# EAGLE design midi_to_cv (EAGLE 7.1.0)
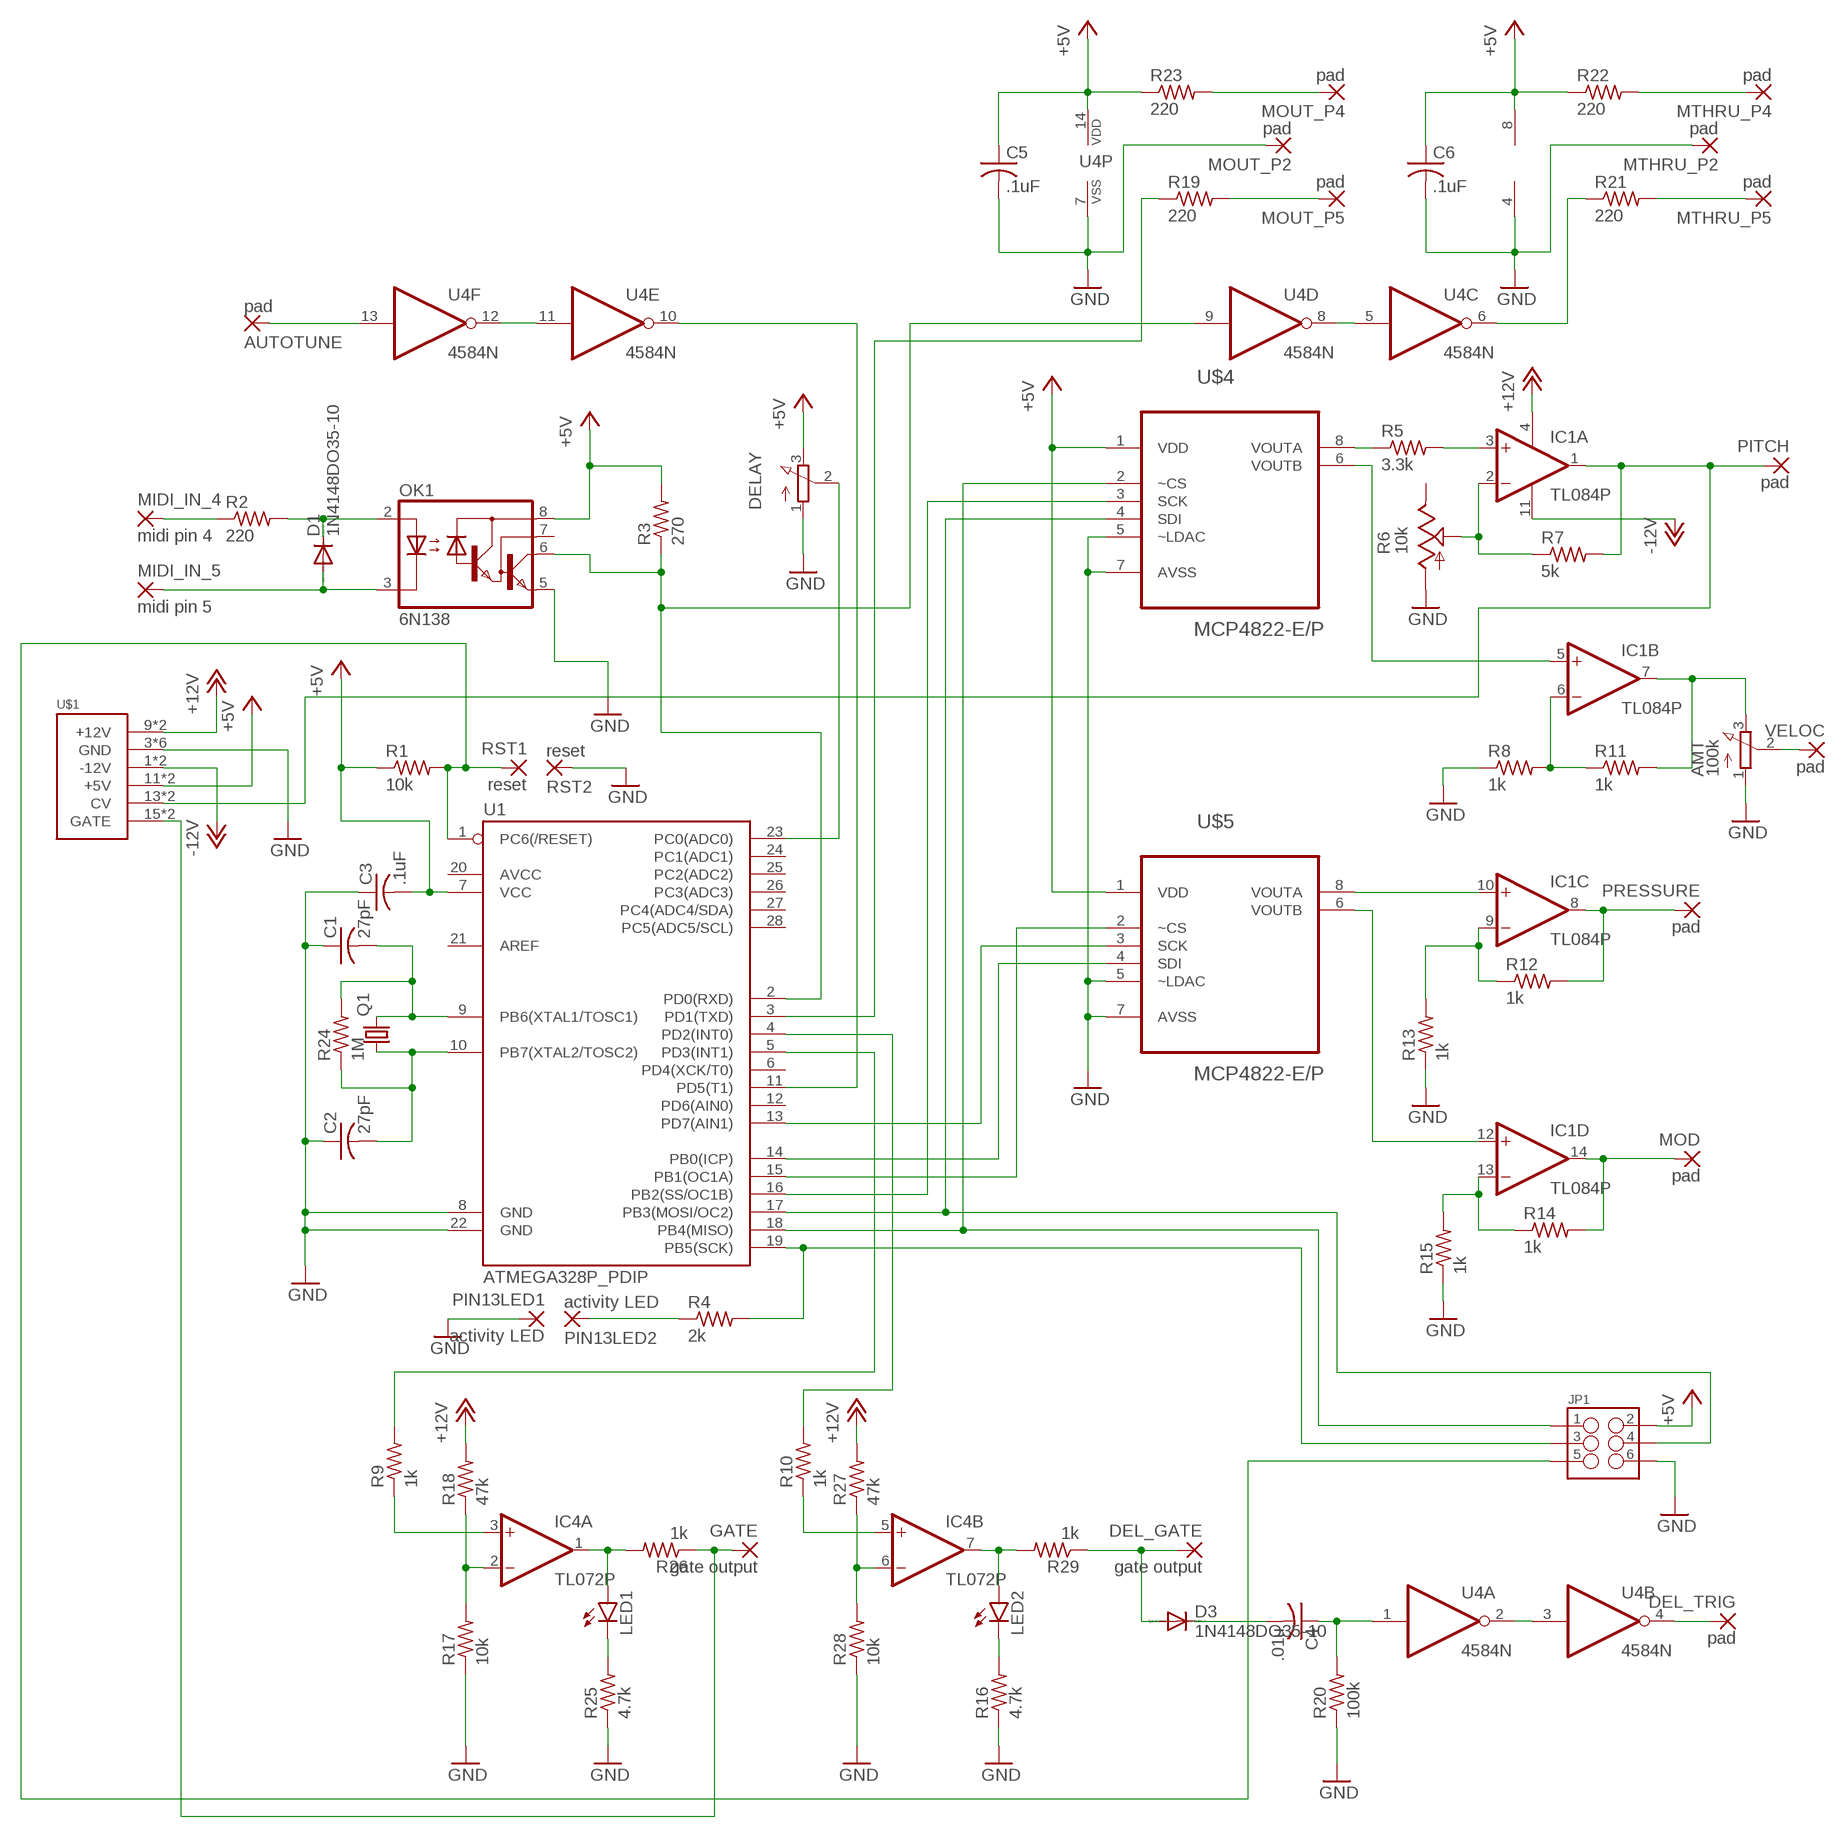
[diagram p0: schematic, sheet 1]

## Parts
AMT  100k  3RP/1610N  [3RP/1610N]
AUTOTUNE  pad  2,54/0,9  [2,54/0,9]
C1  27pF  C-US025-040X050  [C025-040X050]
C2  27pF  C-US025-040X050  [C025-040X050]
C3  .1uF  C-US050-024X044  [C050-024X044]
C4  .01u  C-US050-024X044  [C050-024X044]
C5  .1uF  C-US050-024X044  [C050-024X044]
C6  .1uF  C-US050-024X044  [C050-024X044]
D1  1N4148DO35-10  [DO35-10]
D3  1N4148DO35-10  [DO35-10]
DEL_GATE  gate output  2,54/0,9  [2,54/0,9]
DEL_TRIG  pad  2,54/0,9  [2,54/0,9]
DELAY  3RP/1610N  [3RP/1610N]
GATE  gate output  2,54/0,9  [2,54/0,9]
IC1  TL084P  [DIL14]
IC4  TL072P  [DIL08]
JP1  M03X2NO_SILK  [2X3-NS]
LED1  LED3MM  [LED3MM]
LED2  LED3MM  [LED3MM]
MIDI_IN_4  midi pin 4  2,54/0,9  [2,54/0,9]
MIDI_IN_5  midi pin 5  2,54/0,9  [2,54/0,9]
MOD  pad  2,54/0,9  [2,54/0,9]
MOUT_P2  pad  2,54/0,9  [2,54/0,9]
MOUT_P4  pad  2,54/0,9  [2,54/0,9]
MOUT_P5  pad  2,54/0,9  [2,54/0,9]
MTHRU_P2  pad  2,54/0,9  [2,54/0,9]
MTHRU_P4  pad  2,54/0,9  [2,54/0,9]
MTHRU_P5  pad  2,54/0,9  [2,54/0,9]
OK1  6N138  [DIL08]
PIN13LED1  activity LED  2,54/0,9  [2,54/0,9]
PIN13LED2  activity LED  2,54/0,9  [2,54/0,9]
PITCH  pad  2,54/0,9  [2,54/0,9]
PRESSURE  pad  2,54/0,9  [2,54/0,9]
Q1  CRYSTALHC33U-V  [HC33U-V]
R1  10k  R-US_0207/10  [0207/10]
R2  220  R-US_0207/10  [0207/10]
R3  270  R-US_0207/10  [0207/10]
R4  2k  R-US_0207/10  [0207/10]
R5  3.3k  R-US_0207/10  [0207/10]
R6  10k  TRIM_US-B64W  [B64W]
R7  5k  R-US_0207/10  [0207/10]
R8  1k  R-US_0207/10  [0207/10]
R9  1k  R-US_0207/10  [0207/10]
R10  1k  R-US_0207/10  [0207/10]
R11  1k  R-US_0207/10  [0207/10]
R12  1k  R-US_0207/10  [0207/10]
R13  1k  R-US_0207/10  [0207/10]
R14  1k  R-US_0207/10  [0207/10]
R15  1k  R-US_0207/10  [0207/10]
R16  4.7k  R-US_0207/10  [0207/10]
R17  10k  R-US_0207/10  [0207/10]
R18  47k  R-US_0207/10  [0207/10]
R19  220  R-US_0207/10  [0207/10]
R20  100k  R-US_0207/10  [0207/10]
R21  220  R-US_0207/10  [0207/10]
R22  220  R-US_0207/10  [0207/10]
R23  220  R-US_0207/10  [0207/10]
R24  1M  R-US_0207/10  [0207/10]
R25  4.7k  R-US_0207/10  [0207/10]
R26  1k  R-US_0207/10  [0207/10]
R27  47k  R-US_0207/10  [0207/10]
R28  10k  R-US_0207/10  [0207/10]
R29  1k  R-US_0207/10  [0207/10]
RST1  reset  2,54/0,9  [2,54/0,9]
RST2  reset  2,54/0,9  [2,54/0,9]
U1  ATMEGA328P_PDIP  [DIL28-3]
U4  4584N  [DIL14]
U$1  POWER  [POWER_16]
U$4  MCP4822-E/P  [DIP254P762X432-8]
U$5  MCP4822-E/P  [DIP254P762X432-8]
VELOC  pad  2,54/0,9  [2,54/0,9]

## Nets
+5V: C3.2 C5.1 C6.1 DELAY.3(E) IC4.8(P:V+) JP1.2 OK1.8(VCC) R1.1 R3.2 R22.1 R23.1 U1.7(VCC) U4.14(P:VDD) U$1.11(+5V) U$1.12(+5V) U$4.1(VDD) U$5.1(VDD)
+12V: IC1.4(P:V+) R18.2 R27.2 U$1.9(+12V) U$1.10(+12V)
-12V: IC1.11(P:V-) U$1.1(-12V) U$1.2(-12V)
GND: AMT.1(A) C1.1 C2.1 C3.1 C5.2 C6.2 DELAY.1(A) IC4.4(P:V-) JP1.6 MOUT_P2.1(P) MTHRU_P2.1(P) OK1.5(GND) PIN13LED1.1(P) R6.A R8.1 R13.1 R15.1 R16.1 R17.1 R20.1 R25.1 R28.1 RST2.1(P) U1.8(GND) U1.22(GND) U4.7(P:VSS) U$1.3(GND) U$1.4(GND) U$1.5(GND) U$1.6(GND) U$1.7(GND) U$1.8(GND) U$4.5(~LDAC) U$4.7(AVSS) U$5.5(~LDAC) U$5.7(AVSS)
N$1: IC4.3(A:+IN) R9.1
N$2: R5.1 U$4.8(VOUTA)
N$3: D1.A MIDI_IN_5.1(P) OK1.3(C)
N$4: C1.2 Q1.2 R24.2 U1.9(PB6(XTAL1/TOSC1))
N$5: C2.2 Q1.1 R24.1 U1.10(PB7(XTAL2/TOSC2))
N$6: IC1.3(A:+IN) R5.2
N$7: D1.C OK1.2(A) R2.2
N$8: MIDI_IN_4.1(P) R2.1
N$9: IC1.1(A:OUT) PITCH.1(P) R7.2 U$1.13(CV) U$1.14(CV)
N$10: JP1.3 R4.2 U1.19(PB5(SCK))
N$11: PIN13LED2.1(P) R4.1
N$12: IC1.2(A:-IN) R6.S R7.1
N$13: IC1.6(B:-IN) R8.2 R11.1
N$14: IC1.5(B:+IN) U$4.6(VOUTB)
N$15: IC4.2(A:-IN) R17.2 R18.1
N$16: IC4.1(A:OUT) LED1.A R26.2
N$17: AMT.3(E) IC1.7(B:OUT) R11.2
N$18: IC1.10(C:+IN) U$5.8(VOUTA)
N$19: IC1.8(C:OUT) PRESSURE.1(P) R12.2
N$20: IC1.9(C:-IN) R12.1 R13.2
N$21: IC1.14(D:OUT) MOD.1(P) R14.2
N$22: IC1.13(D:-IN) R14.1 R15.2
N$23: U1.14(PB0(ICP)) U$5.4(SDI)
N$24: IC1.12(D:+IN) U$5.6(VOUTB)
N$25: U1.16(PB2(SS/OC1B)) U$4.3(SCK)
N$26: JP1.4 U1.17(PB3(MOSI/OC2)) U$4.4(SDI)
N$27: DELAY.2(S) U1.23(PC0(ADC0))
N$28: U1.13(PD7(AIN1)) U$5.3(SCK)
N$29: U1.15(PB1(OC1A)) U$5.2(~CS)
N$30: OK1.6(VO) R3.1 U1.2(PD0(RXD)) U4.9(D:I)
N$31: GATE.1(P) R26.1 U$1.15(GATE) U$1.16(GATE)
N$32: R10.2 U1.4(PD2(INT0))
N$33: R9.2 U1.5(PD3(INT1))
N$34: AUTOTUNE.1(P) U4.13(F:I)
N$35: D3.A DEL_GATE.1(P) R29.1
N$36: LED2.K(C) R16.2
N$37: U4.11(E:I) U4.12(F:O)
N$38: U1.11(PD5(T1)) U4.10(E:O)
N$39: U4.5(C:I) U4.8(D:O)
N$40: U4.2(A:O) U4.3(B:I)
N$41: C4.1 R20.2 U4.1(A:I)
N$42: IC4.5(B:+IN) R10.1
N$43: JP1.5 R1.2 RST1.1(P) U1.1(PC6(/RESET))
N$44: IC4.6(B:-IN) R27.1 R28.2
N$45: JP1.1 U1.18(PB4(MISO)) U$4.2(~CS)
N$46: MOUT_P5.1(P) R19.2
N$47: LED1.K(C) R25.2
N$48: C4.2 D3.C
N$49: DEL_TRIG.1(P) U4.4(B:O)
N$50: R21.1 U4.6(C:O)
N$51: AMT.2(S) VELOC.1(P)
N$52: MTHRU_P5.1(P) R21.2
N$53: IC4.7(B:OUT) LED2.A R29.2
N$54: MTHRU_P4.1(P) R22.2
N$55: MOUT_P4.1(P) R23.2
N$57: R19.1 U1.3(PD1(TXD))
Unconnected: OK1.7(VB) R6.E U1.6(PD4(XCK/T0)) U1.12(PD6(AIN0)) U1.20(AVCC) U1.21(AREF) U1.24(PC1(ADC1)) U1.25(PC2(ADC2)) U1.26(PC3(ADC3)) U1.27(PC4(ADC4/SDA)) U1.28(PC5(ADC5/SCL))

## Library data of the parts
AMT DELAY = pot:3RP/1610N: 16mm Potentiometer one level Source: http://www.alphapotentiometers.net/html/16mm_pot_2.html
AUTOTUNE DEL_GATE DEL_TRIG GATE MIDI_IN_4 MIDI_IN_5 MOD MOUT_P2 MOUT_P4 MOUT_P5 MTHRU_P2 MTHRU_P4 MTHRU_P5 PIN13LED1 PIN13LED2 PITCH PRESSURE RST1 RST2 VELOC = wirepad:2,54/0,9: THROUGH-HOLE PAD
C1-C6 = rcl:C-US: CAPACITOR, American symbol
D1 D3 = diode:1N4148: DIODE high speed (Philips)
IC1 = linear:TL084: OP AMP
IC4 = linear:TL072: OP AMP
JP1 = SparkFun-Connectors:M03X2: 2x3 .1" header. Shrouded, with keying- CONN-10681 SMT- CONN-11415 Pogo pins- HW-11044
LED1 LED2 = SparkFun-LED:LED: LEDs Standard schematic elements and footprints for 5mm, 3mm, 1206, and 0603 sized LEDs. 5mm - Spark Fun Electronics SKU : COM-00529 (and others)
OK1 = optocoupler:6N138: MOTOROLA OPTO COUPLER; MF: VISHAY/TELEFUNKEN; MPN: 6N138; OC_FARNELL: 9860150; OC_NEWARK: 35K5294
Q1 = crystal:CRYSTAL: CRYSTAL; OC_FARNELL: unknown; OC_NEWARK: unknown
R1-R5 R7-R29 = rcl:R-US_: RESISTOR, American symbol
R6 = pot:TRIM_US-: POTENTIOMETER
U1 = SparkFun-DigitalIC:ATMEGA328P_PDIP: uC used in the Arduino 32kb flash, 1k EEPROM, 2k SRAM This is the through-hole version of this chip.
U4 = TR808clone:4584: Hex SCHMITT TRIGGER (74C14)
U$1 = eurorack:POWER
U$4 U$5 = MCP4822:MCP4822-E/P: DAC; MPN: MCP4822-E/P; OC_FARNELL: 1439413; OC_NEWARK: 11M1705; PACKAGE: DIP-8; SUPPLIER: Microchip

## Net classes
1 GND: width 1.016 mm, drill 1.016 mm, clearance 0.508 mm

## Board
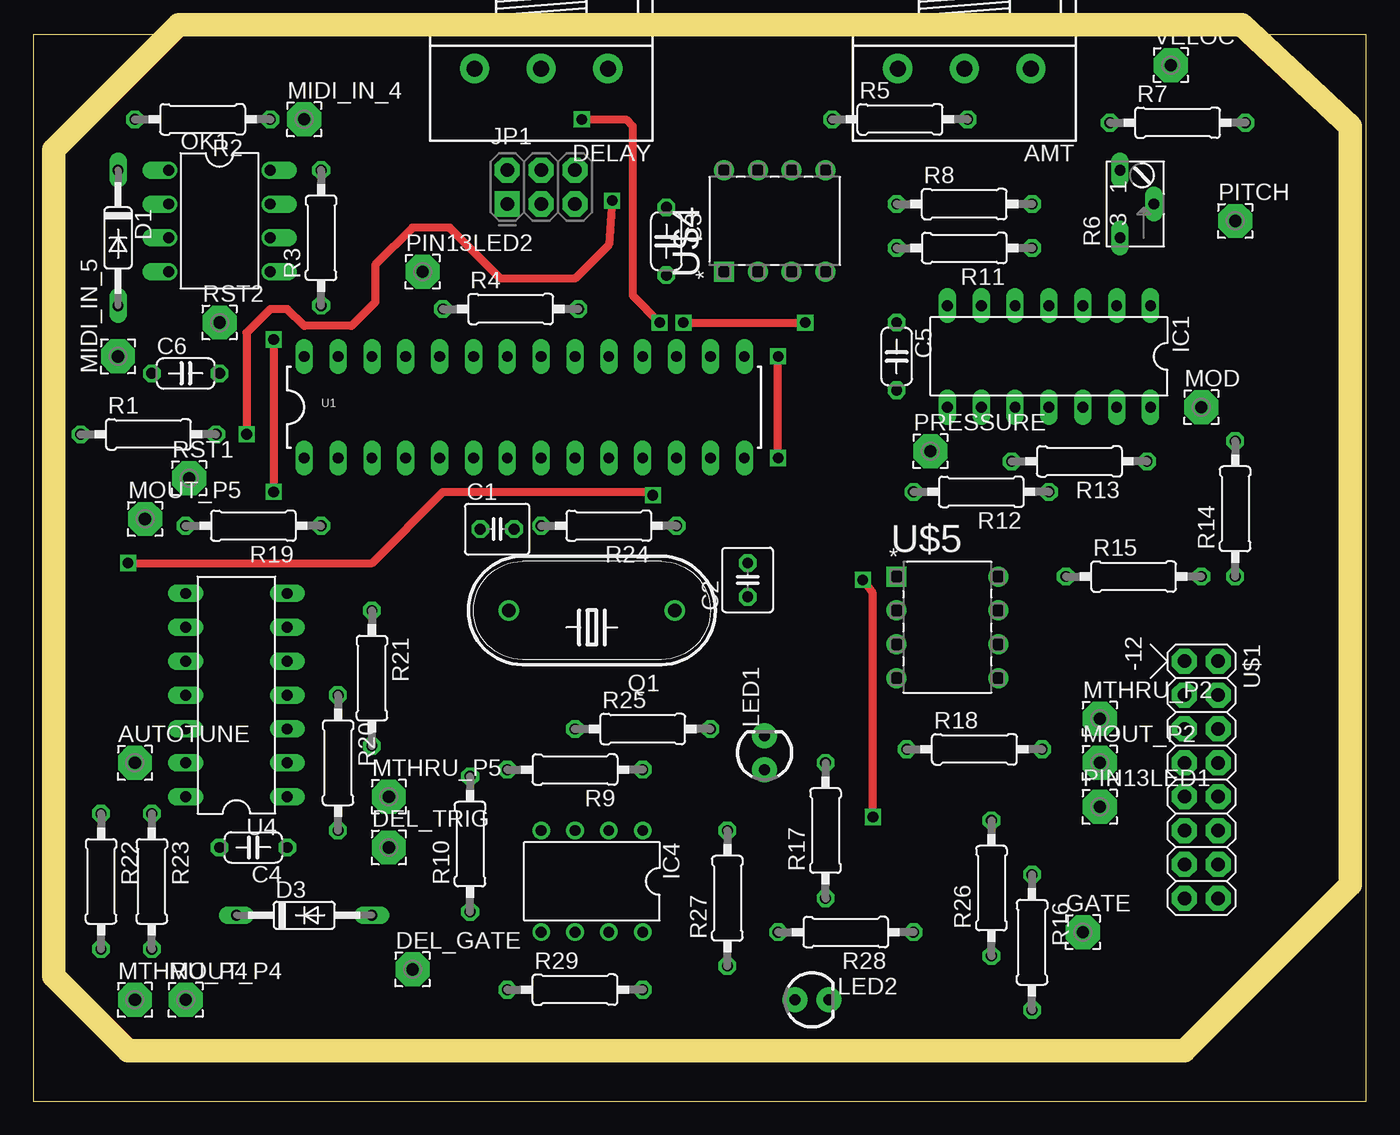
[diagram p1: board, top side]
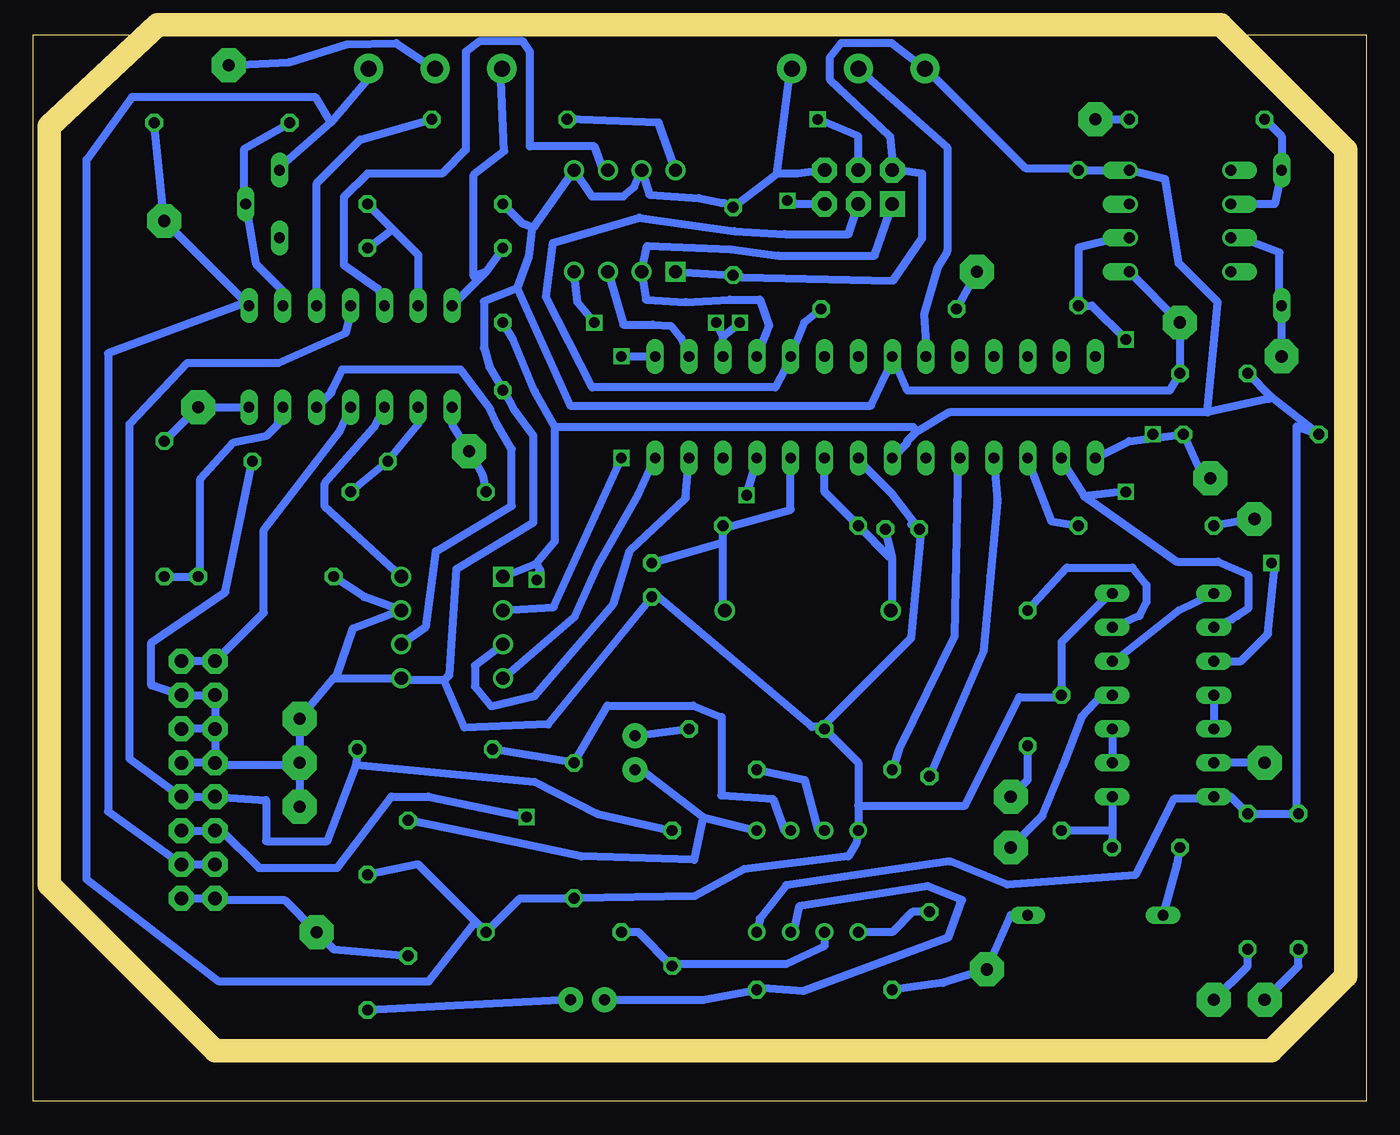
[diagram p2: board, bottom side, seen from below]

Size 100 x 80 mm. Coordinates in mm from the lower left corner, seen from the top.
Outline: 0,0 100,0 100,80 0,80 0,0
Copper layers (1*16): Top 0.035mm / dielectric 1.5mm / Bottom 0.035mm
Design rules "default *": minimum track width 24mil, minimum drill 24mil, track to track 16mil, track to pad 16mil, pad to pad 16mil, via to via 8mil, smd to smd 8mil, copper to edge 0mil, drill to drill 8mil, minimum pad ring 10mil, minimum via ring 8mil, stop-mask expansion 4mil, vias tented up to drill 0mil, thermal gap 10mil
Milling: 8 lines

### Footprints (pad centres in the part's own frame; a part is rotated, then mirrored left to right if it is on the bottom)
3RP/1610N = drill 1.2 pad 2.184: 1 -5,0; 2 0,0; 3 5,0
2,54/0,9 = drill 0.914 pad 2.54 octagon: 1 0,0
C025-040X050 = drill 0.813 octagon: 1 -1.27,0; 2 1.27,0
C050-024X044 = drill 0.813 octagon: 1 -2.54,0; 2 2.54,0
DO35-10 = drill 0.813 long: A 5.08,0; C -5.08,0
DIL14 = drill 0.813 long: 1 -7.62,-3.81; 2 -5.08,-3.81; 3 -2.54,-3.81; 4 0,-3.81; 5 2.54,-3.81; 6 5.08,-3.81; 7 7.62,-3.81; 8 7.62,3.81; 9 5.08,3.81; 10 2.54,3.81; 11 0,3.81; 12 -2.54,3.81; 13 -5.08,3.81; 14 -7.62,3.81
DIL08 = drill 0.813 pad 1.27: 1 -3.81,-3.81; 2 -1.27,-3.81; 3 1.27,-3.81; 4 3.81,-3.81; 5 3.81,3.81; 6 1.27,3.81; 7 -1.27,3.81; 8 -3.81,3.81
2X3-NS = drill 1.016 pad 1.88 square: 1 -2.54,-1.27 | drill 1.016 pad 1.88 octagon: 2 -2.54,1.27; 3 0,-1.27; 4 0,1.27; 5 2.54,-1.27; 6 2.54,1.27
LED3MM = drill 0.813 pad 1.88: A -1.27,0; K 1.27,0
DIL08' = drill 0.813 offset: 1 -3.81,-3.81; 2 -1.27,-3.81; 3 1.27,-3.81; 4 3.81,-3.81; 5 3.81,3.81; 6 1.27,3.81; 7 -1.27,3.81; 8 -3.81,3.81
HC33U-V = drill 1.016: 1 -6.223,0; 2 6.223,0
0207/10 = drill 0.813 octagon: 1 -5.08,0; 2 5.08,0
B64W = drill 0.813 long: A 2.54,0; E -2.54,0; S 0,-2.54
DIL28-3 = drill 0.813 long: 1 -16.51,-3.81; 2 -13.97,-3.81; 3 -11.43,-3.81; 4 -8.89,-3.81; 5 -6.35,-3.81; 6 -3.81,-3.81; 7 -1.27,-3.81; 8 1.27,-3.81; 9 3.81,-3.81; 10 6.35,-3.81; 11 8.89,-3.81; 12 11.43,-3.81; 13 13.97,-3.81; 14 16.51,-3.81; 15 16.51,3.81; 16 13.97,3.81; 17 11.43,3.81; 18 8.89,3.81; 19 6.35,3.81; 20 3.81,3.81; 21 1.27,3.81; 22 -1.27,3.81; 23 -3.81,3.81; 24 -6.35,3.81; 25 -8.89,3.81; 26 -11.43,3.81; 27 -13.97,3.81; 28 -16.51,3.81
POWER_16 = drill 1.016 pad 1.88 octagon: 1 -6.35,-1.27; 2 -6.35,1.27; 3 -3.81,-1.27; 4 -3.81,1.27; 5 -1.27,-1.27; 6 -1.27,1.27; 7 1.27,-1.27; 8 1.27,1.27; 9 3.81,-1.27; 10 3.81,1.27; 11 6.35,-1.27; 12 6.35,1.27; 13 8.89,-1.27; 14 8.89,1.27; 15 11.43,-1.27; 16 11.43,1.27
DIP254P762X432-8 = drill 0.991 square: 1 -7.62,7.62 | drill 0.991: 2 -7.62,5.08; 3 -7.62,2.54; 4 -7.62,0; 5 0,0; 6 0,2.54; 7 0,5.08; 8 0,7.62

### Placement (x,y rotation side)
AMT  69.85,77.47 180 top
AUTOTUNE  7.62,25.4 0 top
C1  34.8,42.93 0 top
C2  53.59,39.12 90 top
C3  47.5,64.52 270 top
C4  16.51,19.05 180 top
C5  64.77,55.88 270 top
C6  11.43,54.61 0 top
D1  6.35,64.77 270 top
D3  20.32,13.97 0 top
DEL_GATE  28.45,9.91 0 top
DEL_TRIG  26.67,19.05 0 top
DELAY  38.1,77.47 180 top
GATE  78.74,12.7 0 top
IC1  76.2,55.88 180 top
IC4  41.91,16.51 180 top
JP1  38.1,68.58 0 top
LED1  54.86,26.16 90 top
LED2  58.42,7.62 0 top
MIDI_IN_4  20.32,73.66 0 top
MIDI_IN_5  6.35,55.88 90 top
MOD  87.63,52.07 0 top
MOUT_P2  80.01,25.4 0 top
MOUT_P4  11.43,7.62 0 top
MOUT_P5  8.38,43.69 0 top
MTHRU_P2  80.01,28.7 0 top
MTHRU_P4  7.62,7.62 0 top
MTHRU_P5  26.67,22.86 0 top
OK1  6N138  [DIL08']  13.97,66.04 270 top
PIN13LED1  80.01,22.1 0 top
PIN13LED2  29.21,62.23 0 top
PITCH  90.17,66.04 0 top
PRESSURE  67.31,48.77 0 top
Q1  41.91,36.83 180 top
R1  8.64,50.04 0 top
R2  12.7,73.66 180 top
R3  21.59,64.77 90 top
R4  35.81,59.44 0 top
R5  65.02,73.66 0 top
R6  81.53,67.31 90 top
R7  85.85,73.41 0 top
R8  69.85,67.31 0 top
R9  40.64,24.89 180 top
R10  32.77,19.3 90 top
R11  69.85,64.01 180 top
R12  71.12,45.72 180 top
R13  78.49,48.01 180 top
R14  90.17,44.45 90 top
R15  82.55,39.37 0 top
R16  74.93,11.94 270 top
R17  59.44,20.32 90 top
R18  70.61,26.42 0 top
R19  16.51,43.18 180 top
R20  22.86,25.4 270 top
R21  25.4,31.75 270 top
R22  5.08,16.51 270 top
R23  8.89,16.51 270 top
R24  43.18,43.18 180 top
R25  45.72,27.94 0 top
R26  71.88,16 90 top
R27  52.07,15.24 90 top
R28  60.96,12.7 180 top
R29  40.64,8.38 0 top
RST1  11.68,46.74 0 top
RST2  13.97,58.42 0 top
U1  36.83,52.07 0 top
U4  15.24,30.48 90 top
U$1  87.63,26.67 270 top
U$4  59.44,69.85 90 top
U$5  72.39,31.75 0 top
VELOC  85.34,77.72 0 top

### Tracks (layer width: path | path; a pad name or v marks a point on that pad's centre or on a via)
+5V  (via drill 0.8)
  Top 0.61: v62.99,21.34 62.99,38.1 v62.23,39.12
  Bottom 0.61: IC4.8 45.5,13.72 43.5,16.22 31.24,18 26.92,16.26 17.34,16.99 14.41,22.7 11.59,22.7 U4.14 10.16,22.86 R23.1 R22.1 5.24,21.75 5.24,50.64 R1.1 7.14,52.86 | U$4.1 C3.2 46.83,61.82 35.5,61.56 33.31,64.77 33.31,69.6 35.08,69.85 JP1.2 35.47,69.75 35.72,72.39 40.26,76.68 40.26,78.26 39.4,79.38 35.59,79.38 33.34,77.63 DELAY.3 33.02,77.47 25.56,70.01 21.75,70.01 R3.2 OK1.8 15.08,69.18 14.06,62.87 11.14,59.94 11.91,51.69 | C5.1 64.01,57.18 62.39,53.28 60.87,50.58 | 60.87,50.58 60.87,42.01 62.23,40.39 | U$5.1 62.23,40.39 | C6.1 7.14,52.86 | U1.7 34.45,49.37 34.45,49.53 33.81,50.16 | 33.81,50.16 31.27,51.69 11.91,51.69 | 11.91,51.69 7.3,52.7 7.14,52.86 | 60.87,50.58 33.97,50.58 33.81,50.16 | U$1.12 U$1.11 85.85,20.32 83.06,17.53 77.22,17.53 73.15,22.86 70.36,22.86 v62.99,21.34 | v62.23,39.12 61.98,39.88 62.23,40.39
+12V
  Bottom 0.61: R27.2 57.72,21.59 62.39,23.97 75.79,25.24 | R18.2 75.79,25.24 | IC1.4 76.3,58.58 76.55,57.66 81.6,55.4 88.42,55.4 92.77,50.8 92.77,25.72 U$1.10 U$1.9 82.55,22.61 82.55,19.53 77.95,19.53 75.79,25.24
-12V
  Bottom 0.61: IC1.11 76.96,50.39 82.71,42.86 82.71,36.67 U$1.1 U$1.2
GND
  Bottom 0.61: OK1.5 RST2.1 C6.2 14.76,53.31 34.42,53.31 35.21,55.12 35.21,55.28 U1.22 35.56,55.56 37.15,52.2 59.72,52.2 63.69,60.99 | 44.2,69.6 42.67,69.6 JP1.6 | 44.2,69.6 C3.1 48.16,67.41 48.39,67.41 50.07,67.75 53.78,68.01 U$4.7 54.93,68.58 55.75,67.88 58.1,67.88 U$4.5 62.42,65.6 62.58,65.6 | 44.2,69.6 43.18,77.47 DELAY.1 | 63.69,60.99 62.83,63.37 62.58,65.6 | 63.69,60.99 66.2,60.01 66.2,56.52 65.79,55.09 C5.2 64.61,53.18 63.85,51.78 62.48,49.91 62.48,43.43 68.26,39.94 68.77,32 69.18,31.59 | 62.58,65.6 63.34,65.88 R8.1 | MOUT_P2.1 PIN13LED1.1 | R15.1 75.18,37.85 U$5.7 76.04,35.47 77.31,31.75 | 77.31,31.75 77.47,31.75 MTHRU_P2.1 MOUT_P2.1 | 77.31,31.75 U$5.5 72.23,31.59 69.18,31.59 | U$1.5 U$1.7 | U$1.7 U$1.8 | U$1.5 U$1.6 | R13.1 85.6,38.2 91.15,34.42 91.15,31.21 U$1.4 U$1.3 U$1.5 | MOUT_P2.1 80.17,25.24 86.2,25.24 U$1.7 | R6.A 81.76,69.85 77.69,73.41 | 77.69,73.41 74.93,76.68 74.93,77.47 AMT.1 | R16.1 71.12,17.78 66.83,13.49 | 66.83,13.49 R28.1 63.5,15.24 R17.1 50.39,15.4 46.67,17.43 38.86,18.38 38.26,19.4 IC4.4 38.1,22.19 | U4.7 19.21,38.1 22.86,34.45 R20.1 23.02,30.32 26.04,30.32 30.1,22.19 38.1,22.19 | U1.8 38.1,48.1 35.56,45.56 C1.1 34.13,43.27 33.37,42.55 33.37,42.8 34.13,34.77 40.64,28.26 R25.1 | 38.1,22.19 38.1,25.4 R25.1 | R25.1 40.8,28.1 41.59,28.1 53.12,37.85 C2.1 61.37,28.29 67.66,28.04 69.18,31.59 | 77.69,73.41 78.87,75.34 92.58,75.34 96.01,70.64 96.01,16.67 86.04,8.98 70.33,8.98 66.83,13.49
N$1
  Bottom 0.61: IC4.3 41.12,20.32 42.13,24.13 R9.1
N$2
  Bottom 0.61: R5.1 53.09,73.41 U$4.8
N$3
  Bottom 0.61: MIDI_IN_5.1 D1.A 6.51,59.85 6.51,63.69 9.37,64.77 OK1.3
N$4
  Bottom 0.61: 35.56,40.8 35.56,36.83 Q1.2 | 35.56,40.8 C1.2 | 35.56,40.8 35.72,40.8 R24.2 40.64,45.72 U1.9
N$5
  Bottom 0.61: 48.26,41.91 48.26,36.83 Q1.1 | 48.26,41.91 R24.1 48.1,43.02 43.18,44.39 U1.10 | 48.26,41.91 C2.2
N$6
  Bottom 0.61: R5.2 75.47,72.14 78.74,68.87 IC1.3
N$7
  Bottom 0.61: R2.2 6.35,72.39 D1.C 6.86,67.31 OK1.2
N$8
  Bottom 0.61: MIDI_IN_4.1 R2.1
N$9
  Bottom 0.61: U$1.13 U$1.14 94.39,21.75 94.39,56.1 84.3,59.85 IC1.1 PITCH.1 R7.2
N$10
  Bottom 0.61: R4.2 42.16,58.42 U1.19 43.18,55.72 44.32,53.56 58.07,53.56 61.53,60.33 61.02,64.39 54.55,66.29 47.4,65.28 43.62,65.06 38.83,65.06 JP1.3
N$11
  Bottom 0.61: PIN13LED2.1 R4.1
N$12
  Bottom 0.61: IC1.2 81.28,60.8 83.31,62.83 R6.S 84.17,67.72 84.17,71.44 81.19,73.15 R7.1
N$13
  Bottom 0.61: IC1.6 71.12,63.5 73.03,65.41 | R8.2 73.03,65.41 | 73.03,65.41 R11.1
N$14
  Bottom 0.61: U$4.6 57.15,69.6 57.91,71.63 62.74,71.63 62.74,78.74 63.25,79.5 66.55,79.5 67.56,78.74 67.56,71.37 69.34,69.6 74.93,69.6 76.71,67.82 76.71,62.74 74.93,61.47 74.17,60.96 IC1.5
N$15
  Bottom 0.61: IC4.2 43.66,20.32 44.51,22.7 48.39,22.95 48.35,25.97 48.35,28.83 50.48,29.69 56.93,29.69 R17.2 R18.1
N$16
  Bottom 0.61: 49.75,21.34 IC4.1 | 49.75,21.34 55.09,25.4 LED1.A | R26.2 64.39,19.56 58.9,18.38 50.42,18.13 49.75,21.34
N$17
  Bottom 0.61: IC1.7 66.04,62.23 | 66.04,62.23 R11.2 | AMT.3 64.93,77.47 64.67,71.28 66.96,69.5 66.96,61.88 66.04,62.23
N$18
  Bottom 0.61: IC1.10 74.42,50.58 78.14,46.35 78.14,44.61 U$5.8
N$19
  Bottom 0.61: R12.2 66.29,46.99 PRESSURE.1 68.58,50.8 IC1.8
N$20
  Bottom 0.61: R12.1 R13.2 71.12,50.8 IC1.9
N$21
  Bottom 0.61: R14.2 MOD.1 IC1.14
N$22
  Bottom 0.61: R14.1 R15.2 87.47,39.53 87.47,46.67 84.96,49.44 82.49,49.94 81.63,50.8 81.63,51.21 IC1.13
N$23
  Bottom 0.61: U1.14 54.61,45.56 57.59,40.29 59.37,36.39 U$5.4
N$24
  Bottom 0.61: IC1.12 77.63,53.18 77.63,53.34 76.83,54.9 67.94,54.9 65.72,51.91 65.22,50.8 64.1,48.93 64.1,44.67 69.79,41.27 70.55,35.62 U$5.6
N$25
  Bottom 0.61: U1.16 51.4,57.24 52.16,58.17 53.53,58.26 55.72,58.26 U$4.3
N$26  (via drill 0.8)
  Top 0.61: v41.15,73.66 44.45,73.66 44.96,73.15 44.96,60.45 v46.99,58.42 | v48.77,58.42 v57.91,58.42 58.17,58.42
  Bottom 0.61: JP1.4 38.1,72.39 v41.15,73.66 | v46.99,58.42 47.24,58.17 48.26,57.4 | U1.17 48.26,57.4 | 48.26,57.4 v48.77,58.42 | v57.91,58.42 59.18,59.94 U$4.4
N$27
  Bottom 0.61: U1.23 33.02,56.86 33.18,59.05 32.16,62.55 31.43,63.79 31.43,71.56 DELAY.2
N$28
  Bottom 0.61: U1.13 51.05,45.24 55.21,41.34 56.48,37.31 62.36,30.42 65.66,29.65 66.86,31.11 66.86,32.7 U$5.3
N$29  (via drill 0.8)
  Top 0.61: v55.88,48.26 v55.88,55.88
  Bottom 0.61: U$5.2 60.96,37.08 v55.88,48.26 | v55.88,55.88 U1.15
N$30  (via drill 0.8)
  Top 0.61: v18.03,57.15 v18.03,45.72
  Bottom 0.61: U4.9 10.06,36.16 9.65,36.42 8.86,36.96 8.86,39.5 11.11,40.48 14.22,40.48 21.16,45.39 | 21.16,45.39 22.86,48.1 U1.2 | OK1.6 18.57,64.77 21.59,64.04 R3.1 20.57,59.69 v18.03,57.15 | v18.03,45.72 18.29,45.72 21.16,45.39
N$31
  Bottom 0.61: U$1.16 U$1.15 86.2,15.08 81.12,15.08 GATE.1 77.47,11.43 R26.1
N$32
  Bottom 0.61: R10.2 28.7,33.78 28.19,39.37 27.69,45.05 27.94,48.1 U1.4
N$33
  Bottom 0.61: R9.2 35.05,26.42 30.89,34.89 30.64,48.1 U1.5
N$34
  Bottom 0.61: AUTOTUNE.1 U4.13
N$35
  Bottom 0.61: D3.A 26.67,13.97 DEL_GATE.1 31.75,8.89 R29.1
N$36
  Bottom 0.61: LED2.K R16.2
N$37
  Bottom 0.61: U4.11 U4.12
N$38  (via drill 0.8)
  Top 0.61: v7.11,40.39 25.4,40.39 30.73,45.72 46.23,45.72 v46.48,45.47
  Bottom 0.61: U4.10 9.4,33.02 7.37,35.05 6.86,40.13 v7.11,40.39 | v46.48,45.47 45.97,47.24 U1.11
N$39
  Bottom 0.61: U4.8 14.06,36.83 18.89,33.02 U4.5
N$40
  Bottom 0.61: U4.3 U4.2
N$41
  Bottom 0.61: U4.1 19.05,20.32 | 19.05,20.32 C4.1 | 19.05,20.32 R20.2
N$42
  Bottom 0.61: R10.1 34.04,14.22 35.56,12.7 IC4.5
N$43  (via drill 0.8)
  Top 0.61: v43.43,67.56 43.18,64.26 40.64,61.72 35.05,61.72 31.24,65.53 28.45,65.53 25.65,62.74 25.65,59.94 23.88,58.17 20.32,58.17 19.05,59.44 17.78,59.44 16,57.66 v16,50.04
  Bottom 0.61: 16.34,49.71 17.78,49.53 U1.1 | 16.34,49.71 R1.2 12.45,47.24 RST1.1 | JP1.5 42.67,67.31 v43.43,67.56 | v16,50.04 v16,50.05 16.34,49.71
N$44
  Bottom 0.61: IC4.6 40.61,11.68 43.5,10.32 51.91,10.32 R27.1 54.61,12.7 R28.2
N$45
  Bottom 0.61: U1.18 45.05,57.5 44.8,58.17 45.5,60.13 47.75,60.13 51.05,59.94 54.04,60.13 U$4.2 53.94,64.17 47.62,63.91 44.1,63.44 36.89,63.44 JP1.1
N$46
  Bottom 0.61: MOUT_P5.1 R19.2
N$47
  Bottom 0.61: LED1.K R25.2
N$48
  Bottom 0.61: D3.C 14.22,17.78 C4.2
N$49
  Bottom 0.61: U4.4 19.91,30.39 21.34,28.86 22.77,25.15 24.29,21.43 DEL_TRIG.1
N$50
  Bottom 0.61: U4.6 18.7,35.66 17.02,36.42 16.48,37.47 16.48,38.73 17.53,40.04 22.45,40.04 R21.1
N$51
  Bottom 0.61: AMT.2 69.25,77.47 70.14,77.6 72.77,79.38 76.49,79.28 80.8,77.95 VELOC.1
N$52
  Bottom 0.61: R21.2 25.4,24.13 MTHRU_P5.1
N$53
  Bottom 0.61: LED2.A 49.75,7.62 R29.2 45.31,8.54 42.23,8.29 31.34,12.32 30.32,15.11 32.89,16.16 42.55,14.64 42.96,12.7 IC4.7
N$54
  Bottom 0.61: R22.2 5.08,10.16 MTHRU_P4.1
N$55
  Bottom 0.61: R23.2 8.89,10.16 MOUT_P4.1
N$57
  Bottom 0.61: R19.1 23.62,43.53 25.4,48.1 U1.3